# Altium schematic sheet SHDN-BSPD-S09-V00-ShutdownRelay.SchDoc: Shutdown Relay
size A3; DrawnBy: Jonn Dillon; DocumentNumber: 9; Revision: 01; SheetNumber: 9; SheetTotal: 10
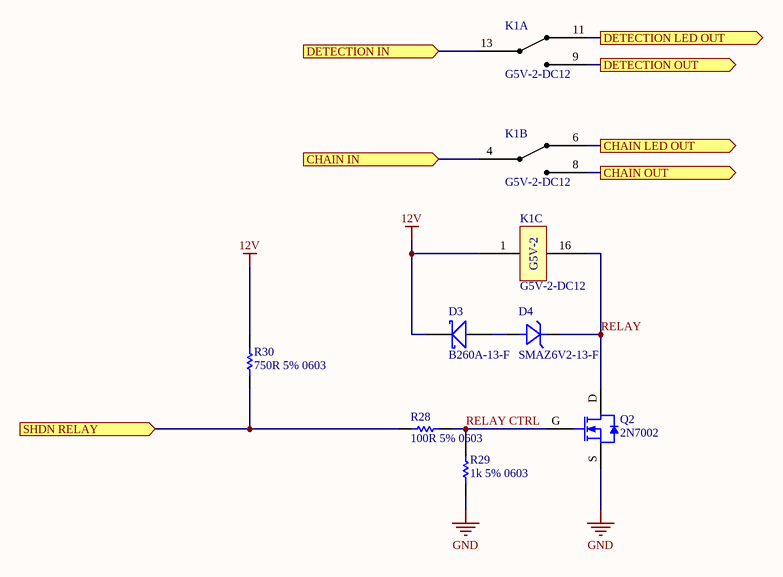
[diagram p0: SHDN-BSPD-S09-V00-ShutdownRelay.SchDoc]

## Parts
D3  B260A-13-F  [SMA]
D4  SMAZ6V2-13-F  [SMA]
K1  G5V-2-DC12  [G5V-2]  (parts A,B,C of 3)
Q2  2N7002  [SOT23-3]
R28  100R 5% 0603  [Res_ThinFilm_0603]
R29  1k 5% 0603  [Res_ThinFilm_0603]
R30  750R 5% 0603  [Res_ThinFilm_0603]

## Ports
CHAIN IN (in), CHAIN LED OUT (out), CHAIN OUT (out), DETECTION IN (in), DETECTION LED OUT (out), DETECTION OUT (out), SHDN RELAY (in)

## Nets
12V: D3.K K1.1 R30.2
GND: Q2.S R29.1
CHAIN IN: K1.4 ; port CHAIN IN
CHAIN LED OUT: K1.6 ; port CHAIN LED OUT
CHAIN OUT: K1.8 ; port CHAIN OUT
DETECTION IN: K1.13 ; port DETECTION IN
DETECTION LED OUT: K1.11 ; port DETECTION LED OUT
DETECTION OUT: K1.9 ; port DETECTION OUT
RELAY: D4.K(Cathode) K1.16 Q2.D
RELAY CTRL: Q2.G R28.2 R29.2
SHDN RELAY: R28.1 R30.1 ; port SHDN RELAY
NetD3_A: D3.A D4.A(Anode)

## Notes on the sheet
- Revision History:
- Sheet Title:
- Rev
- Date
- Description
- Project:
- Size:
- Drawn By:
- A3
- Number:
- Revision:
- Sheet
- Version:
- of
- QUT Motorsport
- O-120, Gardens Point
- 2 George Street
- Brisbane, QLD 4000
- Australia
- Print Date:
- Print Time:
- File Name:
- (in symbol G5V-2-DC12, part C) G5V-2

## Library data of the parts
D3 = B260A-13-F: Diode, Schottky Barrier Rectifier, 60 V, 2 A, B260A-13-F
D4 = SMAZ6V2-13-F: Zener Diode 6.2V 1W ±5% Surface Mount SMA; Manufacturer: Generic; MPN: 5V6 500mW SMA
K1 = G5V-2-DC12: General Purpose Relay DPDT (2 Form C) Through Hole, 12V, 2A
R28 = 100R 5%, 0603: Resistor, SMD, 100R, 0.1W, 5%, 0603
R29 = 1k 5% 0603: Resistor, SMD, 1k, 0.1W, 5%, 0603
R30 = 820R 5% 0603: Resistor, SMD, 750R, 0.1W, 5%, 0603